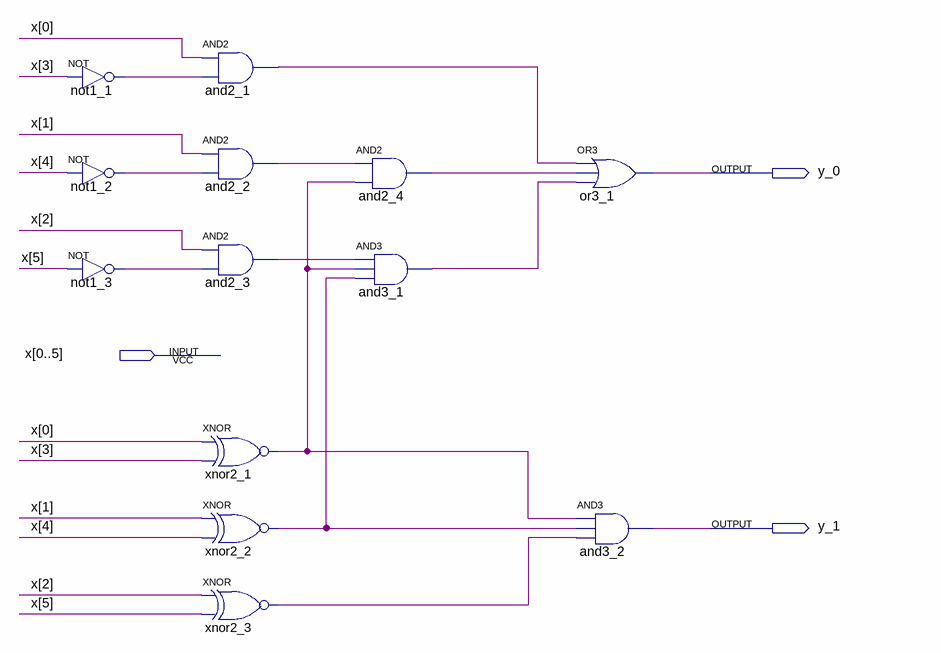
[diagram p0: schematic sheet]
// Quartus schematic Laboratory_work_3_project.bdf as structural Verilog: 13 symbols, 3 pins
module Laboratory_work_3_project (
  input  [0:5] x,
  output y_0,
  output y_1
);

  wire and2_1_out, and2_2_out, and2_3_out, and2_4_out, and3_1_out, not1_1_out, not1_2_out, not1_3_out,
       xnor2_1_out, xnor2_2_out, xnor2_3_out;

  not not1_1 (not1_1_out, x[3]);
  not not1_2 (not1_2_out, x[4]);
  not not1_3 (not1_3_out, x[5]);
  and and2_1 (and2_1_out, x[0], not1_1_out);
  and and2_2 (and2_2_out, x[1], not1_2_out);
  and and2_3 (and2_3_out, x[2], not1_3_out);
  xnor xnor2_1 (xnor2_1_out, x[0], x[3]);
  xnor xnor2_2 (xnor2_2_out, x[1], x[4]);
  xnor xnor2_3 (xnor2_3_out, x[2], x[5]);
  and and2_4 (and2_4_out, and2_2_out, xnor2_1_out);
  and and3_1 (and3_1_out, and2_3_out, xnor2_1_out, xnor2_2_out);
  or or3_1 (y_0, and2_1_out, and2_4_out, and3_1_out);
  and and3_2 (y_1, xnor2_1_out, xnor2_2_out, xnor2_3_out);
endmodule
